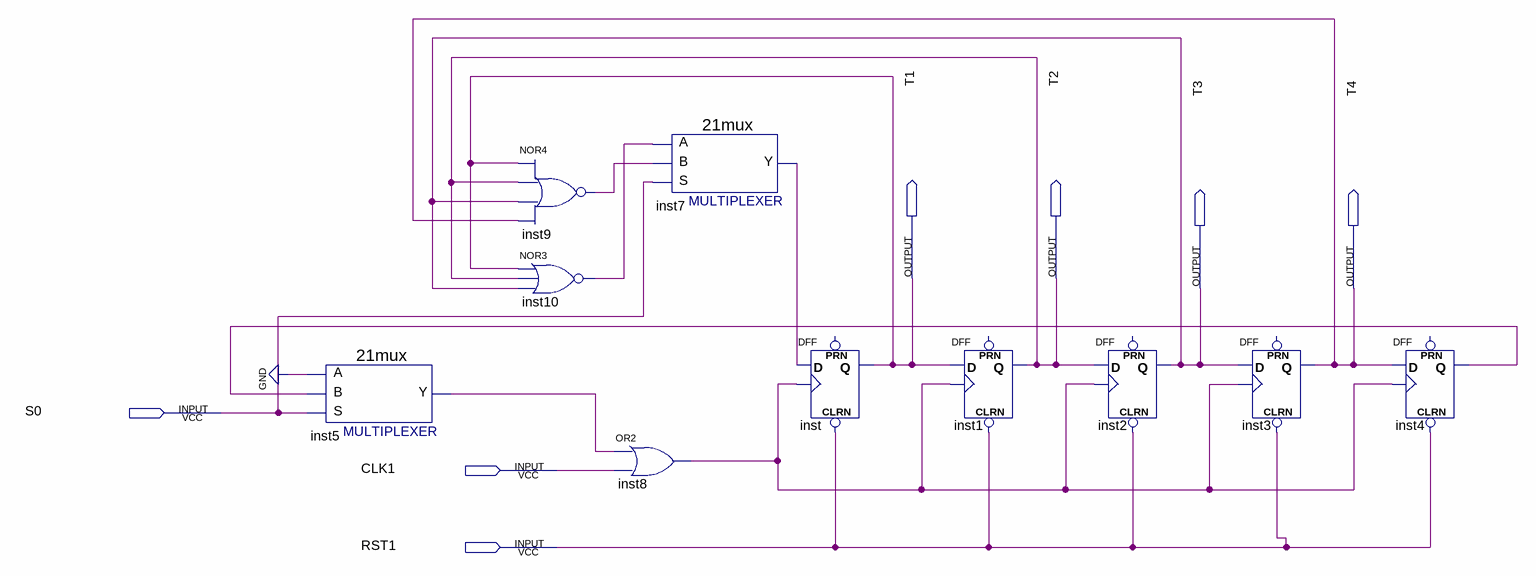
[diagram p0: schematic sheet]
// Quartus schematic ttf.bdf as structural Verilog: 10 symbols, 7 pins
module ttf (
  input  S0,
  input  CLK1,
  input  RST1,
  output T1,
  output T2,
  output T3,
  output T4
);

  wire inst4_q, inst5_y, inst7_y, inst8_out, inst9_out, inst10_out;

  \21mux  inst5 (.S(S0), .B(inst4_q), .A(1'b0), .Y(inst5_y));
  nor inst9 (inst9_out, T1, T2, T3, T4);
  nor inst10 (inst10_out, T1, T2, T3);
  \21mux  inst7 (.S(S0), .B(inst9_out), .A(inst10_out), .Y(inst7_y));
  or inst8 (inst8_out, inst5_y, CLK1);
  DFF inst (.CLRN(RST1), .CLK(inst8_out), .D(inst7_y), .Q(T1));  // open: PRN
  DFF inst1 (.CLRN(RST1), .CLK(inst8_out), .D(T1), .Q(T2));  // open: PRN
  DFF inst2 (.CLRN(RST1), .CLK(inst8_out), .D(T2), .Q(T3));  // open: PRN
  DFF inst3 (.CLRN(RST1), .CLK(inst8_out), .D(T3), .Q(T4));  // open: PRN
  DFF inst4 (.CLRN(RST1), .CLK(inst8_out), .D(T4), .Q(inst4_q));  // open: PRN
endmodule
